# EAGLE schematic lampka (EAGLE 7.2.0)
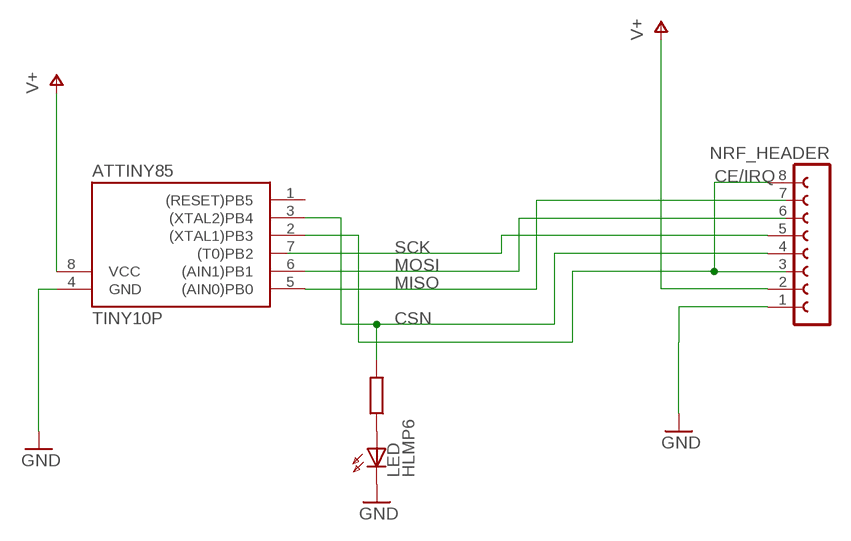
[diagram p0: schematic, sheet 1]

## Parts
ATTINY85  TINY10P  [DIL08]
LED  HLMP6  [HLMP6]
NRF_HEADER  FE08-1  [FE08]

## Nets
CE/IRQ: ATTINY85.2((XTAL1)PB3) NRF_HEADER.8
CSN: ATTINY85.3((XTAL2)PB4) NRF_HEADER.4
GND: ATTINY85.4(GND) LED.K NRF_HEADER.1
MISO: ATTINY85.5((AIN0)PB0)
MOSI: ATTINY85.6((AIN1)PB1)
SCK: NRF_HEADER.5
V+: ATTINY85.8(VCC) NRF_HEADER.2
Unconnected: ATTINY85.1((RESET)PB5) ATTINY85.7((T0)PB2) LED.A NRF_HEADER.3 NRF_HEADER.6 NRF_HEADER.7

## Library data of the parts
ATTINY85 = atmel:TINY10: MICROCONTROLLER 1 Kbytes ROM; OC_FARNELL: unknown; OC_NEWARK: unknown
LED = display-hp:HLMP6: LED 2mm horizontal; MF: AGILENT TECHNOLOGIES; MPN: HLMP-6500; OC_FARNELL: 1652490; OC_NEWARK: 40K0088
NRF_HEADER = con-lsta:FE08-1: FEMALE HEADER; OC_FARNELL: unknown; OC_NEWARK: unknown